# Altium project LD_Cufflink.PrjPcb
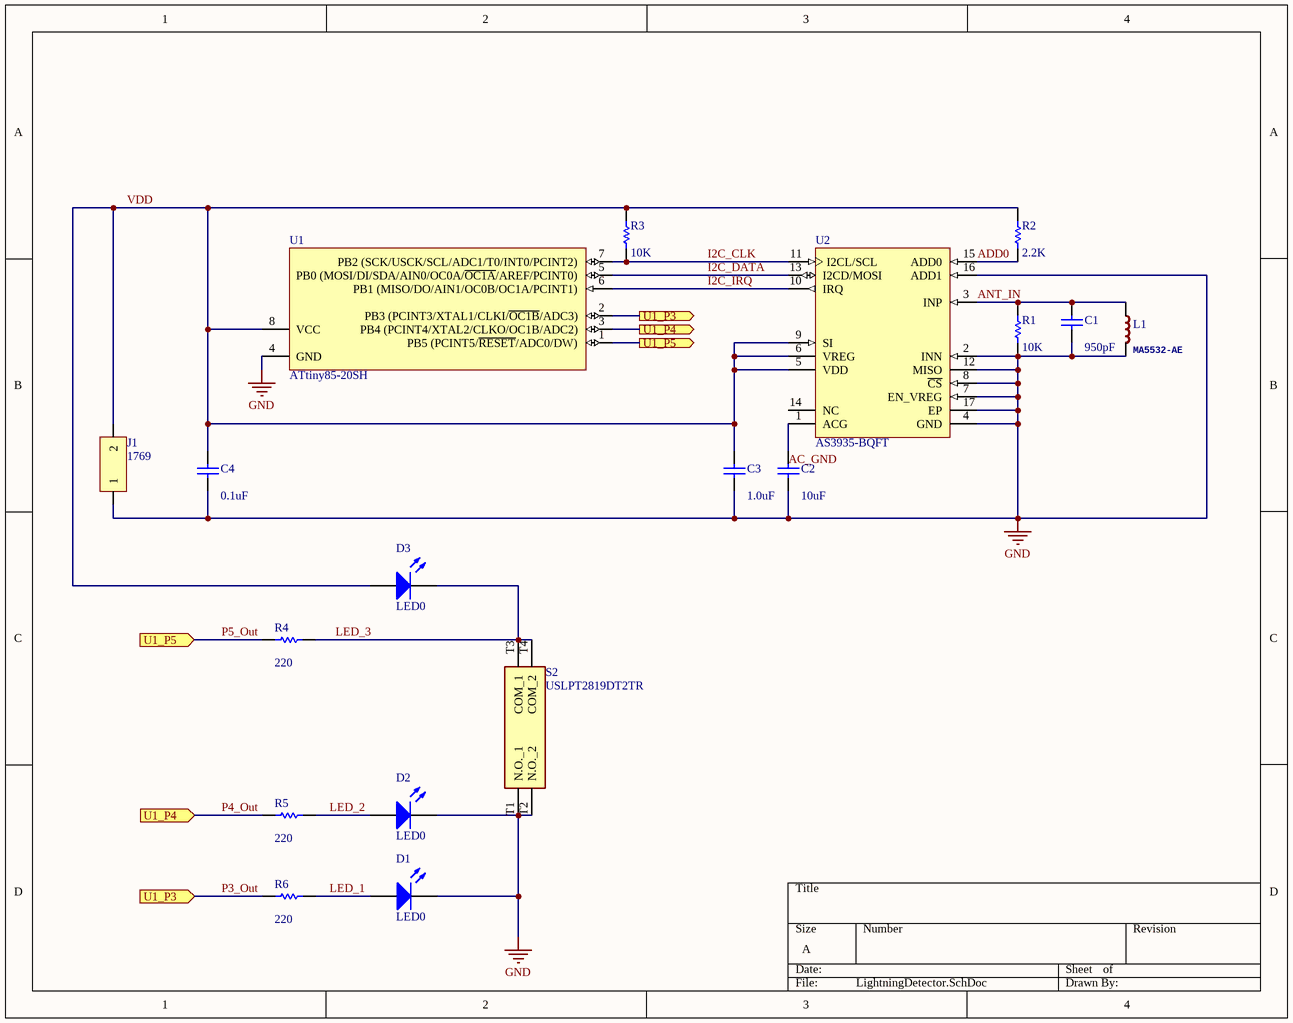
[diagram p0: LightningDetector.SchDoc]
1 sheet, 18 parts. Net scope: flat (ports and power ports of the same name join across sheets).
Board file: LightningDetector.PcbDoc

## Sheet LightningDetector.SchDoc
size A

### Parts
C1  value 950pF  [0805]  (hidden comment: 885382207004)
C2  value 10uF  [0603]  (hidden comment: JMK107ABJ106KA-T)
C3  value 1.0uF  [0603]  (hidden comment: CC0603KRX5R8BB105)
C4  value 0.1uF  [0603]  (hidden comment: CC0603JRX7R9BB104)
D1  LED0  [0805]
D2  LED0  [0805]
D3  LED0  [0805]
J1  1769  [1769]
L1  MA5532-AE  [MA5532-AE]
R1  value 10K  [0805]  (hidden comment: WIN-T0805LF-11-1002-A)
R2  value 2.2K  [0603]  (hidden comment: ESR03EZPJ222)
R3  value 10K  [0603]  (hidden comment: CRCW060310K0JNEAC)
R4  value 220  [0603]  (hidden comment: RC0603FR-07220RL)
R5  value 220  [0603]  (hidden comment: RC0603FR-07220RL)
R6  value 220  [0603]  (hidden comment: RC0603FR-07220RL)
S2  USLPT2819DT2TR  [USLPT2819DT2TR]
U1  ATtiny85-20SH  [8S2_L]
U2  AS3935-BQFT  [AMS-MLPQ-16-4000X4000DE-2675X2675TP_N]

### Ports
U1_P3 (in), U1_P3 (out), U1_P4 (in), U1_P4 (out), U1_P5 (in), U1_P5 (out)

### Nets
GND: C1.1 C2.1 C3.1 C4.1 D1.2(K) D2.2(K) J1.1 L1.2 R1.1 S2.T1(N.O._1) S2.T2(N.O._2) U1.4(GND) U2.2(INN) U2.4(GND) U2.7(EN_VREG) U2.8(~{CS}) U2.12(MISO) U2.16(ADD1) U2.17(EP)
AC_GND: C2.2 U2.1(ACG)
ADD0: R2.1 U2.15(ADD0)
ANT_IN: C1.2 L1.1 R1.2 U2.3(INP)
I2C_CLK: R3.1 U1.7(PB2_(SCK/USCK/SCL/ADC1/T0/INT0/PCINT2)) U2.11(I2CL/SCL)
I2C_DATA: U1.5(PB0_(MOSI/DI/SDA/AIN0/OC0A/~{OC1A}/AREF/PCINT0)) U2.13(I2CD/MOSI)
I2C_IRQ: U1.6(PB1_(MISO/DO/AIN1/OC0B/OC1A/PCINT1)) U2.10(IRQ)
LED_1: D1.1(A) R6.2
LED_2: D2.1(A) R5.2
LED_3: D3.2(K) R4.2 S2.T3(COM_1) S2.T4(COM_2)
P3_Out: R6.1 U1.2(PB3_(PCINT3/XTAL1/CLKI/~{OC1B}/ADC3)) ; port U1_P3
P4_Out: R5.1 U1.3(PB4_(PCINT4/XTAL2/CLKO/OC1B/ADC2)) ; port U1_P4
P5_Out: R4.1 U1.1(PB5_(PCINT5/~{RESET}/ADC0/DW)) ; port U1_P5
VDD: C3.2 C4.2 D3.1(A) J1.2 R2.2 R3.2 U1.8(VCC) U2.5(VDD) U2.6(VREG) U2.9(SI)

Not connected (* = marked no-connect by the designer): U2 14(NC)

### Library data of the parts
C1 = Cap: SMD 0805 1nF    10% 50VDC; PackageDescription: 0805; Part Number: 885382207004
C2 = Cap: SMD 0603 10uF  10% 6.3V; PackageReference: 0603; PackageDescription: Multilayer Ceramic Capacitors MLCC - SMD/SMT 0603 6.3V 10uF 10% X5R
C3 = Cap: SMD 0603 1.0uF 10% 25V; PackageReference: 0603; PackageDescription: Multilayer Ceramic Capacitors MLCC - SMD/SMT 1.0uF 25V X5R 10%
C4 = Cap: Capacitor; PackageReference: 0603; PackageDescription: Multilayer Ceramic Capacitors MLCC - SMD/SMT .1uF 50V X7R 5%
D1-D3 = LED0: Typical INFRARED GaAs LED; Published: 8-Jun-2000; LatestRevisionDate: 08-Jul-2005; LatestRevisionNote: Mech Layer 1 removed.; PackageReference: LED-0; Publisher: Altium Limited; PackageDescription: LED; 2 Leads
J1 = 1769: Accessories JST 2 Pin power connector
L1 = MA5532-AE: GateName_1: G$1; SymbolName_1: INDUCTOR-1; PROD_ID: NDUC-11334; LibraryName: SparkFun-Coils; DeviceSetName: MA5532-AE; Package: MA5532-AE
R1-R6 = Res1: Resistor
  R1: PackageReference: 0805; PackageDescription: Axial Device, Thru-Hole; 2 Leads; 0.3 in Pin Spacing; Part Number: WIN-T0805LF-11-1002-A
  R2: PackageReference: 0603; PackageDescription: Thick Film Resistors - SMD 0603 2K2ohm 5% Anti Surge AEC-Q200; Part Number: ESR03EZPJ222
  R3: PackageReference: 0603; PackageDescription: Thick Film Resistors - SMD 1/10Watt 10Kohms 5% Commercial Use
  R4: PackageReference: 0603; PackageDescription: Axial Device, Thru-Hole; 2 Leads; 0.3 in Pin Spacing
  R5 R6: PackageReference: 0603; PackageDescription: Thick Film Resistors - SMD 220 OHM 1%
S2 = USLPT2819DT2TR: Tactile Switches; Manufacturer_Name: TE Connectivity; Datasheet Link: https://componentsearchengine.com/Datasheets/1/USLPT2819DT2TR.pdf; Height: 0.6mm; Mouser Part Number: 506-USLPT2819DT2TR; Mouser Price/Stock: https://www.mouser.com/Search/Refine.aspx?Keyword=506-USLPT2819DT2TR; Manufacturer_Part_Number: USLPT2819DT2TR
U1 = CMP-0093-00347-1: 8-bit AVR Microcontroller, 20MHz, 2.7-5.5V; ComponentLink3Description: ATtiny25/45/85 Summary; ComponentLink2URL: http://www.atmel.com/dyn/resources/prod_documents/doc2586.pdf; DatasheetVersion: revN, Apr-2011; ComponentLink1URL: http://www.atmel.com/; PackageDescription: 8-Lead, 0.208" Body, Plastic Small Outline Package (EIAJ); ComponentLink1Description: Manufacturer URL; ComponentLink2Description: ATtiny25/45/85 Datasheet; PackageVersion: revF, Apr-2008; PackageReference: 8S2; ComponentLink3URL: http://www.atmel.com/dyn/resources/prod_documents/2586S.pdf
U2 = CMP-0557-00001-2: Franklin Lightning Sensor(TM) IC, 2.4 to 5.5 V, MLPQ-16, Pb-Free, Reel; Manufacturer: AMS; Current Consumption (uA): 0.4 / 50 / 210; Interface: SPI or IÂ²C; PackageDescription: 16-Pin Plastic Quad Flatpack, No Leads, 4 x 4 mm Body, 0.65 mm Pitch, 2.675 x 2.675 mm Exposed Pad; PackageVersion: Rev. 1.2, 07/2012; DatasheetVersion: Rev. 1.2; ComponentLink2URL: http://www.ams.com/eng/content/download/249847/974777/143418; PackageReference: MLPQ-16; Supply (V): 2.4 to 5.5; Mounting Technology: Surface Mount; ComponentLink1Description: Manufacturer URL; ComponentLink2Description: Datasheet; PartNumber: AS3935-BQFT; ComponentLink1URL: www.ams.com